# Altium schematic sheet connector_pump.SchDoc
size A
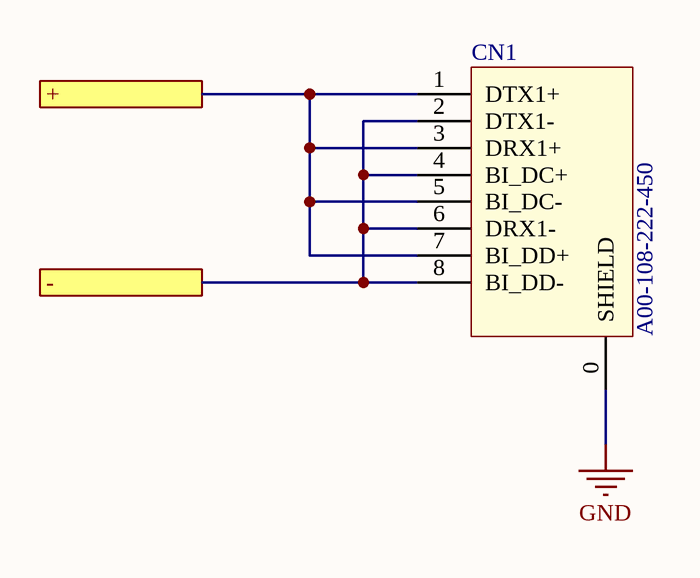
[diagram p0: connector_pump.SchDoc]

## Parts
CN1  MFG P/N: A00-108-222-450  [RJ45 TOP ENTRY EDAC A00-108-222-450]  (hidden comment: CONN_RJ45_TOP_A00-108-222-450)

## Ports
+, -

## Nets
GND: CN1.0(SHIELD)
+: CN1.1(DTX1+) CN1.3(DRX1+) CN1.5(BI_DC-) CN1.7(BI_DD+) ; port +
-: CN1.2(DTX1-) CN1.4(BI_DC+) CN1.6(DRX1-) CN1.8(BI_DD-) ; port -

## Library data of the parts
CN1 = 492: CONN, RJ-45, 1-PORT, 8-POS, VERT, 0.76um GOLD, TH; ID: 492; MFG: EDAC Inc; COMMON: 210-00203-00; XPN: XS-10003929; Status: In Development; RoHS Compliant: Yes; LOON: 210-00203-00; Gecko: 210-00203-00